# Altium schematic sheet RADM-USB-S03-V00.SchDoc: RADM USB (USB-C, FTDI USB -> UART, ESD Protection)
size A3; DrawnBy: Jonn Dillon; DocumentNumber: 4; SheetNumber: 4; SheetTotal: 6; Version: 00; Project: QUTMS RADIO M2M; PageSetup: Record=PageOptions|CenterHorizontal=True|CenterVertical=True|PrintScale=0.97|XCorrection=1.00|YCorrection=1.00|PrintKind=0|BorderSize=5000000|LeftOffset=0|BottomOffset=0|Orientation=2|PaperLength=1000|PaperWidth=1000|Scale=100|PaperSource=7|PrintQuality=-4|MediaType=1|DitherType=10|PaperKind=A4|PrintScaleMode=1
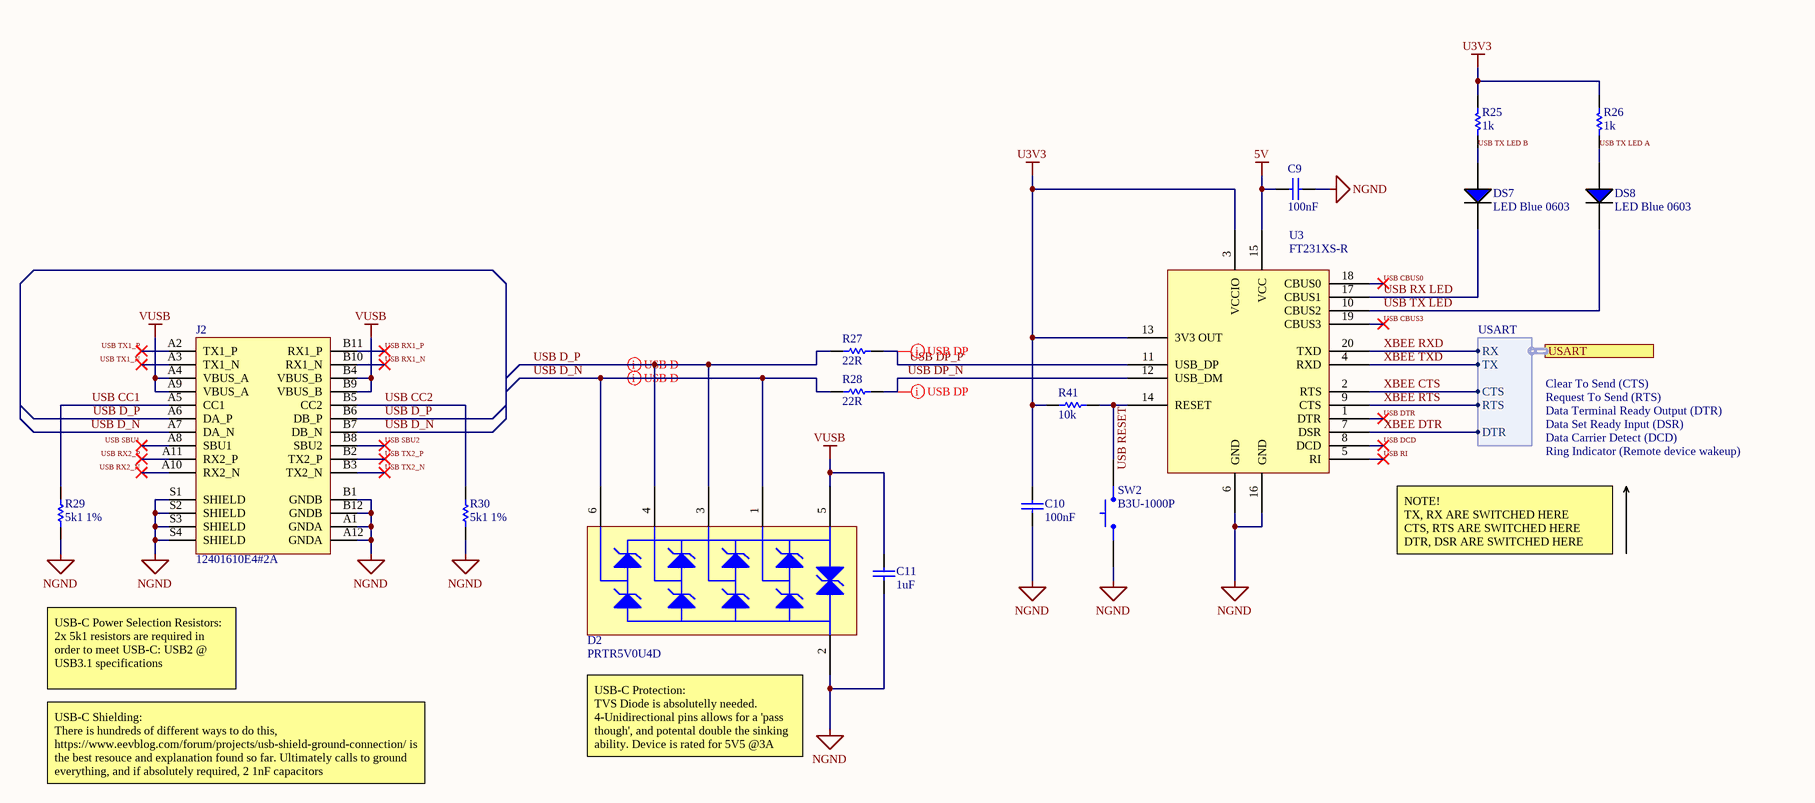
[diagram p0: RADM-USB-S03-V00.SchDoc]

## Parts
C9  100nF  [Cap_Ceramic_0603]
C10  100nF  [Cap_Ceramic_0603]
C11  1uF  [Cap_Ceramic_0603]
D2  PRTR5V0U4D  [SC-47]
DS7  LED Blue 0603  [LED BLUE 0603]
DS8  LED Blue 0603  [LED BLUE 0603]
J2  12401610E4#2A  [12401610E4#2A]
R25  1k  [Res_ThinFilm_0603]
R26  1k  [Res_ThinFilm_0603]
R27  22R  [Res_ThinFilm_0603]
R28  22R  [Res_ThinFilm_0603]
R29  5k1 1%  [Res_ThinFilm_0603]
R30  5k1 1%  [Res_ThinFilm_0603]
R41  10k  [Res_ThinFilm_0603]
SW2  B3U-1000P  [BTN B3U-1000P]
U3  FT231XS-R  [SSOP-20]

## Ports
USART (harness USART)

## Harnesses
USART: TX, RX, RTS, CTS, DTR

## Nets
5V: C9.2 U3.15(VCC)
NGND: C9.1 C10.1 C11.1 D2.2(GND) J2.A1(GNDA) J2.A12(GNDA) J2.B1(GNDB) J2.B12(GNDB) J2.S1(SHIELD) J2.S2(SHIELD) J2.S3(SHIELD) J2.S4(SHIELD) R29.1 R30.1 SW2.1 U3.6(GND) U3.16(GND)
U3V3: C10.2 R25.1 R26.1 R41.1 U3.3(VCCIO) U3.13(3V3_OUT)
VUSB: C11.2 D2.5(VCC) J2.A4(VBUS_A) J2.A9(VBUS_A) J2.B4(VBUS_B) J2.B9(VBUS_B)
USB CBUS0: U3.18(CBUS0)
USB CBUS3: U3.19(CBUS3)
USB CC1: J2.A5(CC1) R29.2
USB CC2: J2.B5(CC2) R30.2
USB D_N: D2.1(P1) D2.6(P4) J2.A7(DA_N) J2.B7(DB_N) R28.1
USB D_P: D2.3(P2) D2.4(P3) J2.A6(DA_P) J2.B6(DB_P) R27.1
USB DCD: U3.8(DCD)
USB DP_N: R28.2 U3.12(USB_DM)
USB DP_P: R27.2 U3.11(USB_DP)
USB DTR: U3.1(DTR)
USB RESET: R41.2 SW2.2 U3.14(RESET)
USB RI: U3.5(RI)
USB RX1_N: J2.B10(RX1_N)
USB RX1_P: J2.B11(RX1_P)
USB RX2_N: J2.A10(RX2_N)
USB RX2_P: J2.A11(RX2_P)
USB RX LED: DS7.2(C) U3.17(CBUS1)
USB SBU1: J2.A8(SBU1)
USB SBU2: J2.B8(SBU2)
USB TX1_N: J2.A3(TX1_N)
USB TX1_P: J2.A2(TX1_P)
USB TX2_N: J2.B3(TX2_N)
USB TX2_P: J2.B2(TX2_P)
USB TX LED: DS8.2(C) U3.10(CBUS2)
USB TX LED A: DS8.1(A) R26.2
USB TX LED B: DS7.1(A) R25.2
XBEE CTS: U3.2(RTS) ; port USART.CTS
XBEE DTR: U3.7(DSR) ; port USART.DTR
XBEE RTS: U3.9(CTS) ; port USART.RTS
XBEE RXD: U3.20(TXD) ; port USART.RX
XBEE TXD: U3.4(RXD) ; port USART.TX

## Layout directives
differential pair: USB D_N, USB D_P, USB DP_N, USB DP_P

## Notes on the sheet
- Data Set Ready Input (DSR)
- Data Carrier Detect (DCD)
- Data Terminal Ready Output (DTR)
- Clear To Send (CTS)
- Request To Send (RTS)
- Ring Indicator (Remote device wakeup)
- NOTE!
  TX, RX ARE SWITCHED HERE
  CTS, RTS ARE SWITCHED HERE
  DTR, DSR ARE SWITCHED HERE
- USB-C Power Selection Resistors:
  2x 5k1 resistors are required in order to meet USB-C: USB2 @ USB3.1 specifications
- USB-C Shielding:
  There is hundreds of different ways to do this, https://www.eevblog.com/forum/projects/usb-shield-ground-connection/ is the best resouce and explanation found so far. Ultimately calls to ground everything, and if absolutely required, 2 1nF capacitors
- (near D2) USB-C Protection:
  TVS Diode is absolutelly needed. 4-Unidirectional pins allows for a 'pass though', and potental double the sinking ability. Device is rated for 5V5 @3A
- Revision History:
- Sheet Title:
- Rev
- Date
- Description
- Project:
- Size:
- Drawn By:
- A3
- Number:
- Revision:
- Sheet
- Version:
- of
- QUT Motorsport
- O-120, Gardens Point
- 2 George Street
- Brisbane, QLD 4000
- Australia
- Print Date:
- Print Time:
- File Name:

## Library data of the parts
C9 C10 = 100nF 50V 5% X7R 0603: Capacitor, Ceramic, SMD, 100nF, 50V, 5%, X7R, 0603
C11 = 1uF 25V 5% X7R 0603: Capacitor, Ceramic, SMD, 1uF, 25V, 5%, X7R, 0603
D2 = PRTR5V0U4D: Clamp Ipp Tvs Diode Surface Mount 6-TSOP
J2 = 12401610E4#2A: USB-C (USB TYPE-C) USB 3.2 Gen 2 (USB 3.1 Gen 2, Superspeed + (USB 3.1)) Receptacle Connector 24 Position Surface Mount, Right Angle; Through Hole
R25 R26 = 1k 5% 0603: Resistor, SMD, 1k, 0.1W, 5%, 0603
R27 R28 = 22R 5% 0603: Resistor, SMD, 22R, 0.1W, 5%, 0603
R29 R30 = 5k1 1% 0603: Resistor, SMD, 5k1, 0.1W, 1%, 0603
R41 = 10k 5% 0603: Resistor, SMD, 10k, 0.1W, 5%, 0603
SW2 = BTN B3U-1000P: Omron B3U-1000P Ultra Miniture Switch; ComponentLink1Description: LCSC; ComponentLink1URL: https://lcsc.com/product-detail/Tactile-Switches_BRIGHT-TSA063G50-250_C294565.html
U3 = FT231XS-R: USB Bridge, USB to UART USB 2.0 UART Interface 20-SSOP